# EAGLE design USBasp (EAGLE 7.1.0)
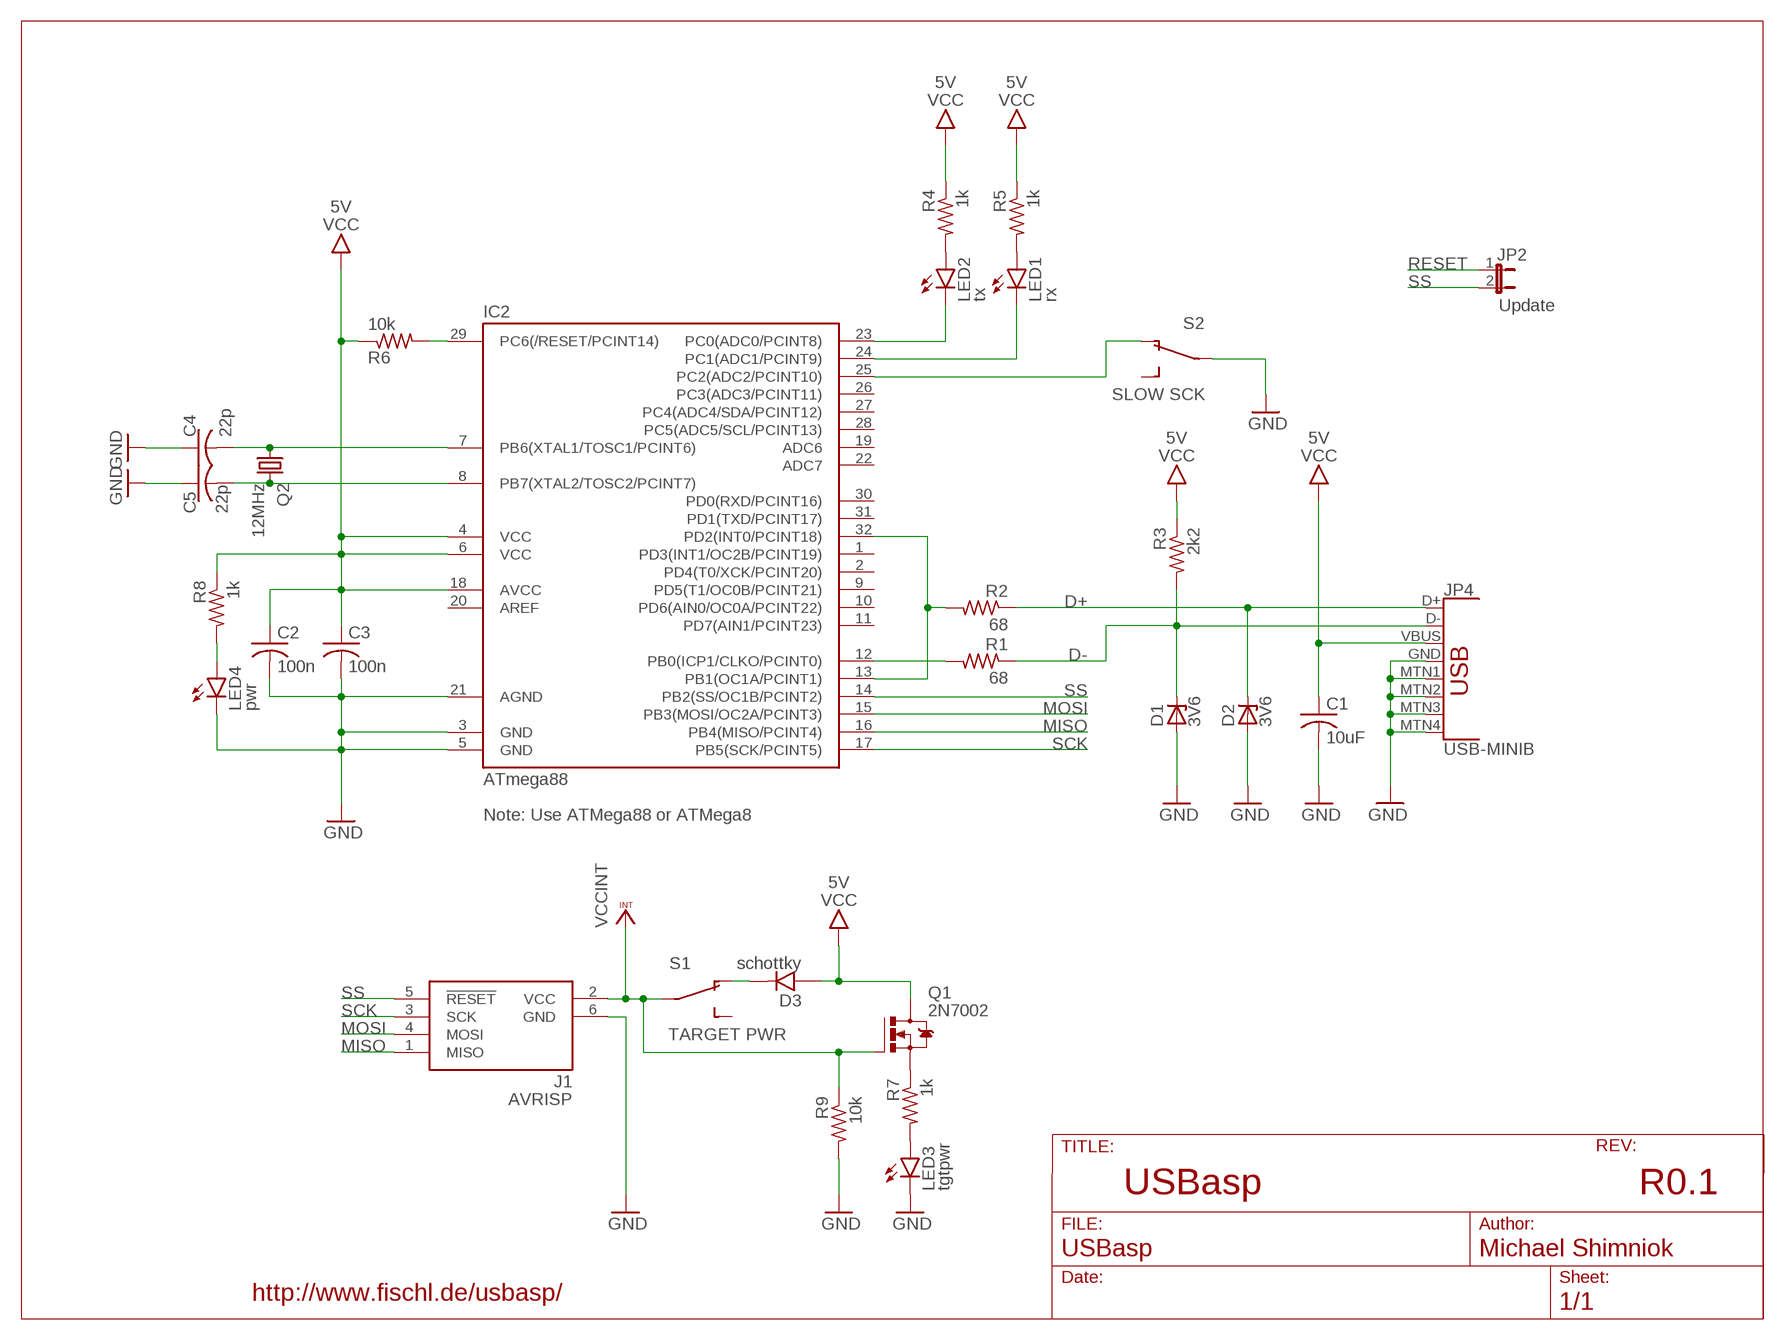
[diagram p0: schematic, sheet 1]

## Parts
C1  10uF  C-1206  [1206]
C2  100n  C-0603  [0603]
C3  100n  C-0603  [0603]
C4  22p  C-0603  [0603]
C5  22p  C-0603  [0603]
D1  3V6  ZENER-DIODESOD80C  [SOD80C]
D2  3V6  ZENER-DIODESOD80C  [SOD80C]
D3  schottky  DIODE_SOD123FL  [SOD123FL]
IC2  ATmega88  MEGA48/88/168-AU  [TQFP32-08]
J1  AVRISP  AVRISP6_COMPACT  [CON6P2R]
JP2  Update  JP1E  [JP1]
JP4  USB-MINIB  [USB-MINIB]
LED1  rx  LEDCHIPLED_1206  [CHIPLED_1206]
LED2  tx  LEDCHIPLED_1206  [CHIPLED_1206]
LED3  tgtpwr  LEDCHIPLED_1206  [CHIPLED_1206]
LED4  pwr  LEDCHIPLED_1206  [CHIPLED_1206]
Q1  2N7002  MOSFET-N-SOT23  [SOT-23]
Q2  12MHz  CRYSTALNDK5X3  [NDK_2PAD_5X3]
R1  68  R0603  [0603]
R2  68  R0603  [0603]
R3  2k2  R0603  [0603]
R4  1k  R0603  [0603]
R5  1k  R0603  [0603]
R6  10k  R0603  [0603]
R7  1k  R0603  [0603]
R8  1k  R0603  [0603]
R9  10k  R0603  [0603]
S1  TARGET PWR  SPDT_OS102011MAQN1  [OS102011MA1Q]
S2  SLOW SCK  SPDT_OS102011MAQN1  [OS102011MA1Q]

## Nets
D+: D2.C JP4.D+ R2.1
D-: D1.C JP4.D- R1.1 R3.2
GND: C1.2(-) C2.2(-) C3.2(-) C4.1(+) C5.1(+) D1.A D2.A IC2.3(GND) IC2.5(GND) IC2.21(AGND) J1.6(GND) JP4.GND JP4.MTN1(SHIELD1) JP4.MTN2(SHIELD2) JP4.MTN3(SHIELD3) JP4.MTN4(SHIELD4) LED3.C LED4.C R9.2 S2.2(P)
MISO: IC2.16(PB4(MISO/PCINT4)) J1.1(MISO)
MOSI: IC2.15(PB3(MOSI/OC2A/PCINT3)) J1.4(MOSI)
N$1: D3.C S1.1(O1)
N$2: LED3.A R7.2
N$3: LED4.A R8.2
N$4: Q1.2(S) R7.1
N$13: LED2.A R4.2
N$25: LED1.A R5.2
PB0: IC2.12(PB0(ICP1/CLKO/PCINT0)) R1.2
PB1: IC2.13(PB1(OC1A/PCINT1)) IC2.32(PD2(INT0/PCINT18)) R2.2
PC0: IC2.23(PC0(ADC0/PCINT8)) LED2.C
PC1: IC2.24(PC1(ADC1/PCINT9)) LED1.C
PC2: IC2.25(PC2(ADC2/PCINT10)) S2.1(O1)
RESET: IC2.29(PC6(/RESET/PCINT14)) JP2.1 R6.2
SCK: IC2.17(PB5(SCK/PCINT5)) J1.3(SCK)
SS: IC2.14(PB2(SS/OC1B/PCINT2)) J1.5(!RESET) JP2.2
VCC: C1.1(+) C2.1(+) C3.1(+) D3.A IC2.4(VCC) IC2.6(VCC) IC2.18(AVCC) JP4.VBUS Q1.3(D) R3.1 R4.1 R5.1 R6.1 R8.1 ; supply symbol labelled 5V
VCCINT: J1.2(VCC) Q1.1(G) R9.1 S1.2(P)
XTAL1: C4.2(-) IC2.7(PB6(XTAL1/TOSC1/PCINT6)) Q2.P$1
XTAL2: C5.2(-) IC2.8(PB7(XTAL2/TOSC2/PCINT7)) Q2.P$2
Unconnected: IC2.1(PD3(INT1/OC2B/PCINT19)) IC2.2(PD4(T0/XCK/PCINT20)) IC2.9(PD5(T1/OC0B/PCINT21)) IC2.10(PD6(AIN0/OC0A/PCINT22)) IC2.11(PD7(AIN1/PCINT23)) IC2.19(ADC6) IC2.20(AREF) IC2.22(ADC7) IC2.26(PC3(ADC3/PCINT11)) IC2.27(PC4(ADC4/SDA/PCINT12)) IC2.28(PC5(ADC5/SCL/PCINT13)) IC2.30(PD0(RXD/PCINT16)) IC2.31(PD1(TXD/PCINT17)) S1.3(O2) S2.3(O2)

## Notes on the sheet
- Note: Use ATMega88 or ATMega8
- USBasp | R0.1
- http://www.fischl.de/usbasp/

## Library data of the parts
C1-C5 = bt_rcl:C: Capacitor, non-polarized, American symbol
D1 D2 = diode:ZENER-DIODE: Z-Diode
D3 = bt_diode:DIODE: Diode Collection of generic diodes in various packages
IC2 = avr-7:MEGA48/88/168
J1 = bt_avr:AVRISP6: 6-pin dual-row connector for Atmel AVRISP programmer interface
JP2 = jumper:JP1E: JUMPER
JP4 = bt_electromech:USB: USB Connectors USB-MINI-B is fully proven USB-A-PCB is untested. USB-MICRO-B is untested.; PROD_ID: CONN-08193
LED1-LED4 = bt_opto:LED: LED Various packages
Q1 = bt_transistor:MOSFET-N: N-Channel MOSFET
Q2 = bt_crystal:CRYSTAL: CRYSTAL
R1-R9 = bt_rcl:R: Resistor, American symbol
S1 S2 = bt_electromech:SPDT: SPDT Switch

## Board
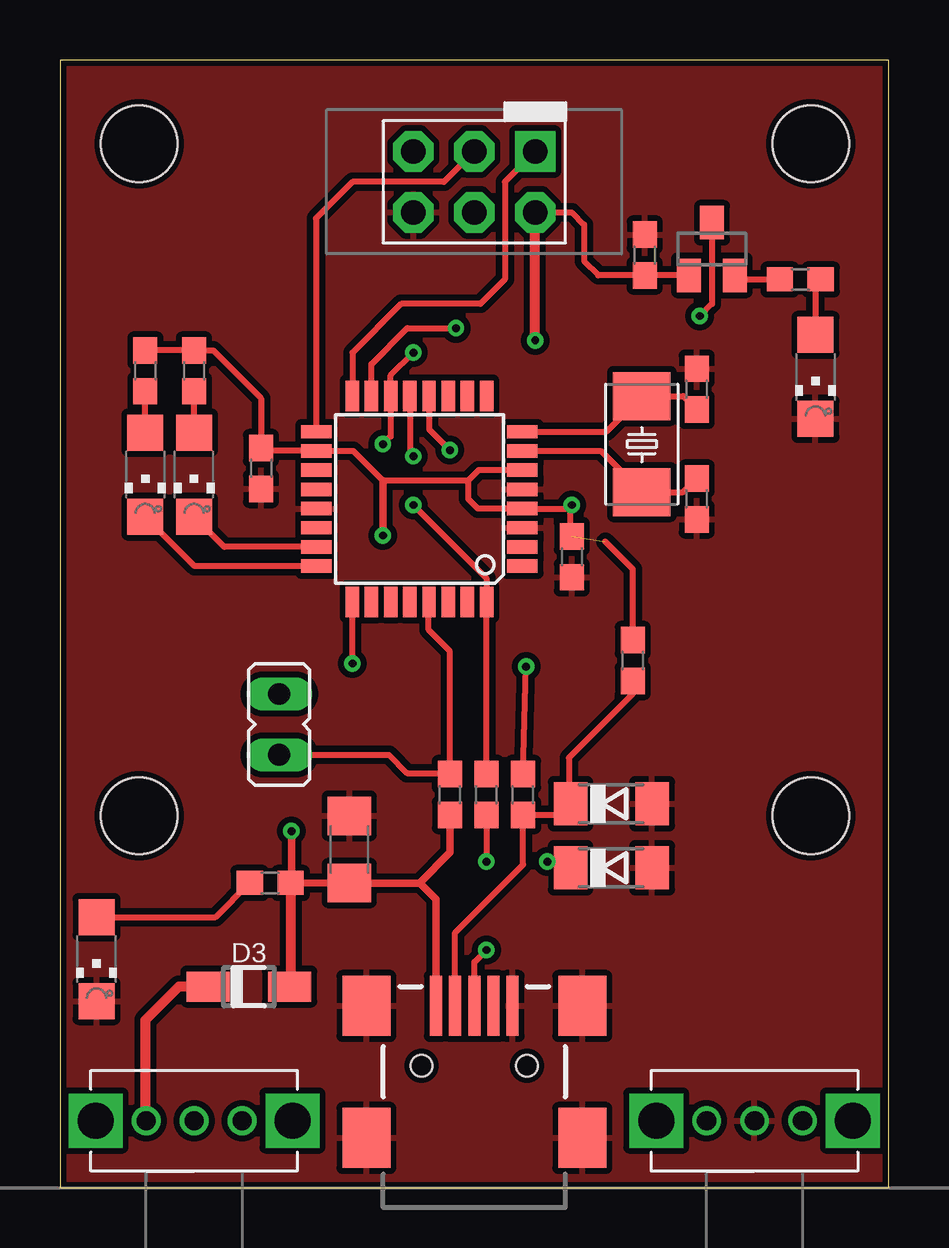
[diagram p1: board, top side]
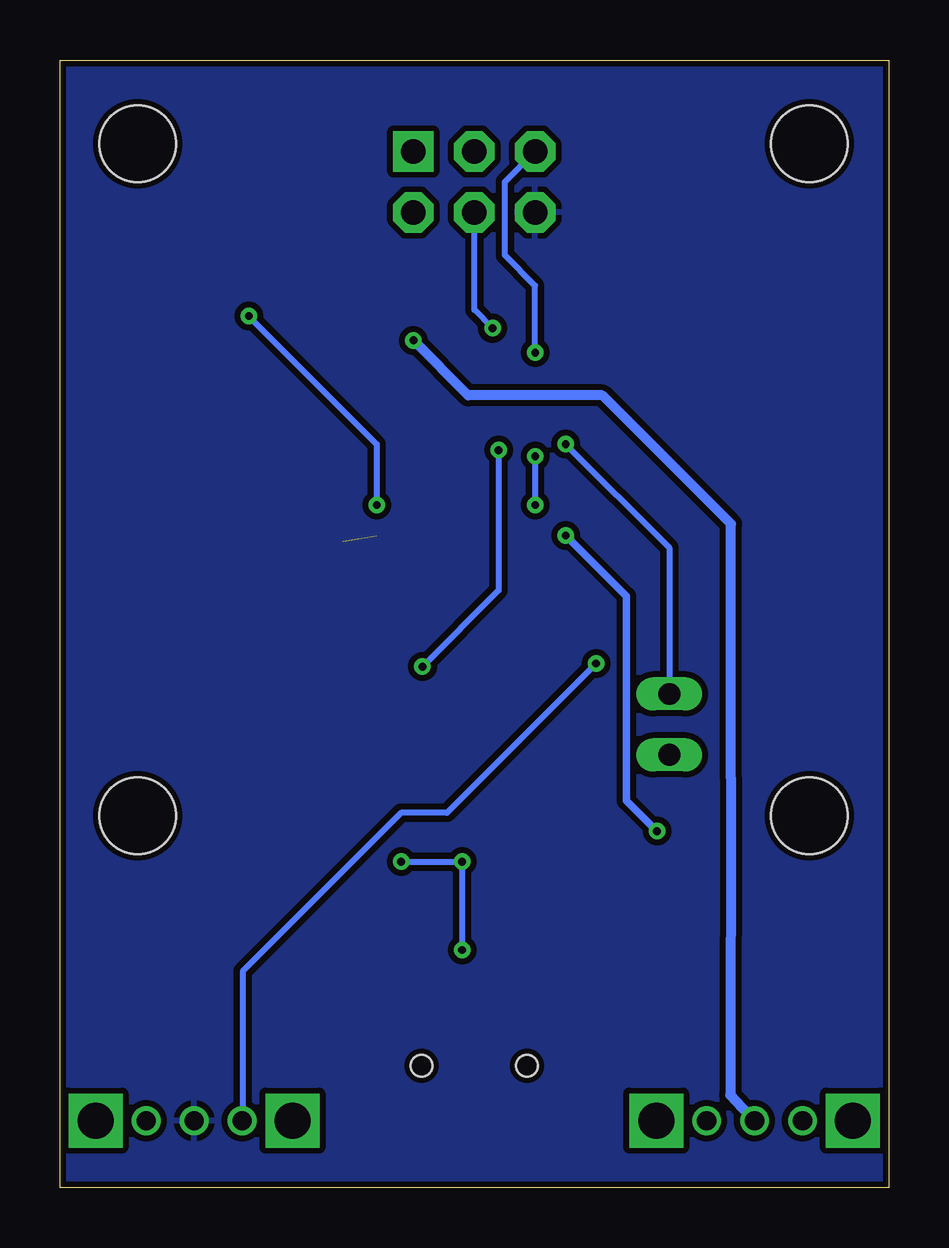
[diagram p2: board, bottom side, seen from below]

Size 34.54 x 46.99 mm. Coordinates in mm from the lower left corner, seen from the top.
Outline: 34.54,0 34.54,46.99 0,46.99 0,0 34.54,0
Copper layers (1*16): Top 0.0356mm / dielectric 1.5011mm / Bottom 0.0356mm
Design rules "LaenPCBOrder *": minimum track width 6mil, minimum drill 13mil, track to track 10mil, track to pad 8mil, pad to pad 8mil, via to via 10mil, smd to smd 8mil, copper to edge 10mil, drill to drill 10mil, minimum pad ring 7mil, minimum via ring 7mil, stop-mask expansion 3mil, vias tented up to drill 20mil, thermal gap 10mil

### Footprints (pad centres in the part's own frame; a part is rotated, then mirrored left to right if it is on the bottom)
1206 = smd 1.6 x 1.8: 1 -1.4,0; 2 1.4,0
0603 = smd 1.1 x 1: 1 -0.85,0; 2 0.85,0
SOD80C = smd 1.4 x 1.8: A 1.7,0; C -1.7,0
SOD123FL = smd 1.8 x 1.25: A 1.7,0; C -1.7,0
TQFP32-08 = smd 1.27 x 0.559: 1 -4.293,2.8; 2 -4.293,2; 3 -4.293,1.2; 4 -4.293,0.4; 5 -4.293,-0.4; 6 -4.293,-1.2; 7 -4.293,-2; 8 -4.293,-2.8; 17 4.293,-2.8; 18 4.293,-2; 19 4.293,-1.2; 20 4.293,-0.4; 21 4.293,0.4; 22 4.293,1.2; 23 4.293,2; 24 4.293,2.8 | smd 0.559 x 1.27: 9 -2.8,-4.293; 10 -2,-4.293; 11 -1.2,-4.293; 12 -0.4,-4.293; 13 0.4,-4.293; 14 1.2,-4.293; 15 2,-4.293; 16 2.8,-4.293; 25 2.8,4.293; 26 2,4.293; 27 1.2,4.293; 28 0.4,4.293; 29 -0.4,4.293; 30 -1.2,4.293; 31 -2,4.293; 32 -2.8,4.293
CON6P2R = drill 1.016 pad 1.676 square: 1 -2.54,-1.27 | drill 1.016 pad 1.676 octagon: 2 -2.54,1.27; 3 0,-1.27; 4 0,1.27; 5 2.54,-1.27; 6 2.54,1.27
JP1 = drill 0.914 long: 1 0,-1.27; 2 0,1.27
USB-MINIB = smd 2.5 x 0.5: D+ 2.5,0; D- 2.5,0.8; GND 2.5,-1.6; ID 2.5,-0.8; VBUS 2.5,1.6 | smd 2.5 x 2: MTN1 -3,4.5; MTN2 2.5,4.5; MTN3 -3,-4.5; MTN4 2.5,-4.5 | hole 0.9: 0,2.2; 0,-2.2
CHIPLED_1206 = smd 1.5 x 1.5: A -1.75,0; C 1.75,0
SOT-23 = smd 1 x 1.4: 1 -0.95,-1.1; 2 0.95,-1.1; 3 0,1.1
NDK_2PAD_5X3 = smd 2 x 2.4: P$1 -2,0; P$2 2,0
OS102011MA1Q = drill 0.8: 1 -2,0; 2 0,0; 3 2,0 | drill 1.5 square: G1 -4.1,0; G2 4.1,0
HAMMOND_1593J = hole 3.2: 15.5,15.5; 43.5,15.5; 15.5,43.5; 43.5,43.5

### Placement (x,y rotation side)
C1  12.06,14.1 90 top
C2  8.38,29.97 270 top
C3  21.34,26.29 270 top
C4  26.54,28.7 90 top
C5  26.54,33.27 270 top
D1  22.99,16 0 top
D2  22.99,13.34 0 top
D3  7.87,8.38 0 top
IC2  14.99,28.7 180 top
J1  17.27,41.91 180 top
JP2  9.14,19.3 0 top
JP4  17.27,5.08 90 top
LED1  3.56,29.72 270 top
LED2  5.59,29.72 270 top
LED3  31.5,33.78 270 top
LED4  1.52,9.53 270 top
Q1  27.18,39.12 0 top
Q2  24.26,30.99 90 top
R1  19.3,16.38 90 top
R2  17.78,16.38 90 top
R3  23.88,21.97 270 top
R4  5.59,34.04 270 top
R5  3.56,34.04 270 top
R6  16.26,16.38 90 top
R7  30.86,37.85 0 top
R8  8.76,12.7 180 top
R9  24.38,38.86 90 top
S1  5.59,2.79 0 top
S2  28.96,2.79 0 top
U$8  [HAMMOND_1593J]  -12.19,0 0 top

### Tracks (layer width: path | path; a pad name or v marks a point on that pad's centre or on a via)
D+  (via drill 0.33)
  Top 0.254: JP4.D+ 17.27,9.4 v17.78,9.91 | R2.1 v17.78,13.59 | D2.C 20.96,13.59 v20.32,13.59
  Bottom 0.254: v17.78,9.91 v17.78,13.59 v20.32,13.59
D-
  Top 0.254: JP4.D- 16.47,10.63 19.3,13.46 R1.1 21.25,15.53 D1.C 21.21,16.08 21.21,17.91 23.88,20.57 R3.2
GND
  pour Top: 0,0 0,46.99 34.54,46.99 34.54,0
  pour Bottom: 0,0 0,46.99 34.54,46.99 34.54,0
MISO
  Top 0.254: J1.1 18.54,41.91 18.54,37.85 17.53,36.83 14.22,36.83 12.19,34.8 IC2.16
MOSI  (via drill 0.33)
  Top 0.254: IC2.15 12.99,34.32 14.48,35.81 v16.51,35.81
  Bottom 0.254: v16.51,35.81 17.27,36.58 J1.4
N$1
  Top 0.406: D3.C 4.95,8.38 3.56,6.99 3.56,2.83 S1.1
N$2
  Top 0.254: R7.2 31.5,37.63 LED3.A
N$3
  Top 0.254: LED4.A 6.49,11.28 R8.2
N$4
  Top 0.254: Q1.2 28.3,37.85 R7.1
N$13
  Top 0.254: LED2.A R4.2
N$25
  Top 0.254: LED1.A R5.2
PB0  (via drill 0.33)
  Top 0.254: IC2.12 15.39,31.6 v16.26,30.73 | R1.2 v19.43,21.72
  Bottom 0.254: v16.26,30.73 16.26,24.89 v19.43,21.72
PB1  (via drill 0.33)
  Top 0.254: IC2.13 14.59,30.63 v14.73,30.48 | v14.73,28.45 17.78,25.4 IC2.32 R2.2
  Bottom 0.254: v14.73,30.48 v14.73,28.45
PC0
  Top 0.254: IC2.23 6.85,26.7 LED2.C
PC1
  Top 0.254: IC2.24 5.62,25.9 LED1.C
PC2  (via drill 0.33)
  Top 0.254: IC2.25 12.19,22.1 v12.19,21.84
  Bottom 0.254: v12.19,21.84 18.42,15.62 20.32,15.62 26.92,9.02 26.92,2.83 S2.1
RESET
  Top 0.254: JP2.1 13.72,18.03 14.48,17.27 16.22,17.27 R6.2 16.26,22.35 15.37,23.24 15.37,24.39 IC2.29
SCK
  Top 0.254: J1.3 16,41.91 12.19,41.91 10.67,40.39 10.67,31.53 IC2.17
SS  (via drill 0.33)
  Top 0.254: v14.73,34.8 13.79,33.85 IC2.14 13.79,31.31 v13.46,30.99
  Bottom 0.254: v14.73,34.8 14.73,37.59 16,38.86 16,41.91 J1.5 | v13.46,30.99 9.14,26.67 JP2.2
VCC  (via drill 0.33)  (1 unrouted)
  Top 0.254: R5.1 R4.1 6.39,34.89 8.38,32.89 C2.1 8.5,30.7 IC2.18 12.22,30.7 13.46,29.46 17.02,29.46 | 21.27,28.3 IC2.4 17.42,28.3 17.02,28.7 17.02,29.46 | 21.27,28.3 21.27,27.5 21.34,27.43 C3.1 | IC2.6 17.46,29.9 17.02,29.46 | Q1.3 27.18,36.83 v26.67,36.32 | v21.34,28.45 21.34,28.37 21.27,28.3 | R3.1 23.88,25.78 22.73,26.92
  Top 0.305: C1.1 11.64,12.7 R8.1 9.65,12.74 v9.65,14.86 | v13.46,27.18 13.46,29.46 | JP4.VBUS 15.67,12.01 14.99,12.7 C1.1 | C1.1 14.98,12.7 16.26,13.97 R6.1
  Top 0.406: R8.1 9.61,8.42 D3.A
  Bottom 0.254: v26.67,36.32 21.34,30.99 v21.34,28.45
  Bottom 0.305: v13.46,27.18 10.92,24.64 10.92,16.13 v9.65,14.86
VCCINT  (via drill 0.33)
  Top 0.254: Q1.1 R9.1 22.44,38.01 21.84,38.61 21.84,40.13 21.34,40.64 J1.2
  Top 0.406: v19.81,35.31 J1.2
  Bottom 0.406: v19.81,35.31 17.53,33.02 11.94,33.02 6.73,27.81 6.6,27.69 6.57,27.65 6.57,17.05 6.6,3.87 S1.2
XTAL1
  Top 0.254: IC2.7 22.54,30.7 Q2.P$1 25.98,28.99 C4.2
XTAL2
  Top 0.254: IC2.8 22.77,31.5 Q2.P$2 25.98,32.99 C5.2